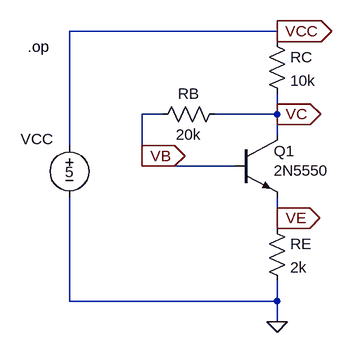
[diagram p0: schematic prob5_17_d.asc]
prob5_17_d.asc, the LTspice schematic file:
Version 4
SHEET 1 880 680
WIRE 240 -32 -80 -32
WIRE 240 -16 240 -32
WIRE 64 96 32 96
WIRE 240 96 240 64
WIRE 240 96 144 96
WIRE 240 128 240 96
WIRE -80 144 -80 -32
WIRE 32 160 32 96
WIRE 32 176 32 160
WIRE 176 176 32 176
WIRE 240 256 240 224
WIRE 240 272 240 256
WIRE -80 384 -80 224
WIRE 240 384 240 352
WIRE 240 384 -80 384
WIRE 240 416 240 384
FLAG 240 -32 VCC
IOPIN 240 -32 Out
FLAG 240 96 VC
IOPIN 240 96 Out
FLAG 240 256 VE
IOPIN 240 256 Out
FLAG 32 160 VB
IOPIN 32 160 Out
FLAG 240 416 0
SYMBOL npn 176 128 R0
WINDOW 0 59 25 Left 2
WINDOW 3 59 55 Left 2
SYMATTR InstName Q1
SYMATTR Value 2N5550
SYMBOL voltage -80 128 R0
WINDOW 0 -75 6 Left 2
WINDOW 3 -7 57 Left 2
SYMATTR InstName VCC
SYMATTR Value 5
SYMBOL res 224 -32 R0
SYMATTR InstName RC
SYMATTR Value 10k
SYMBOL res 224 256 R0
SYMATTR InstName RE
SYMATTR Value 2k
SYMBOL res 160 80 R90
WINDOW 0 0 56 VBottom 2
WINDOW 3 32 56 VTop 2
SYMATTR InstName RB
SYMATTR Value 20k
TEXT -144 -8 Left 2 !.op

The netlist it stands for:
* prob5_17_d.asc
Q1 VC VB VE 0 2N5550
VCC VCC 0 5
RC VCC VC 10k
RE VE 0 2k
RB VC VB 20k
.model NPN NPN
.model PNP PNP
.lib standard.bjt
.op
.backanno
.end

* Results of the author's LTspice run, read from the files saved beside the schematic
* Operating Point:
*   V(vc) = 1.454 V
*   V(vb) = 1.373 V
*   V(ve) = 709.2 mV
*   V(vcc) = 5 V
*   Ic(Q1) = 350.6 µA
*   Ib(Q1) = 4.045 µA
*   Ie(Q1) = -354.6 µA
*   I(Rc) = 354.6 µA
*   I(Re) = 354.6 µA
*   I(Rb) = 4.045 µA
*   I(Vcc) = -354.6 µA